# Altium schematic sheet Power.SchDoc
size A; SheetNumber: 2; SheetTotal: 3
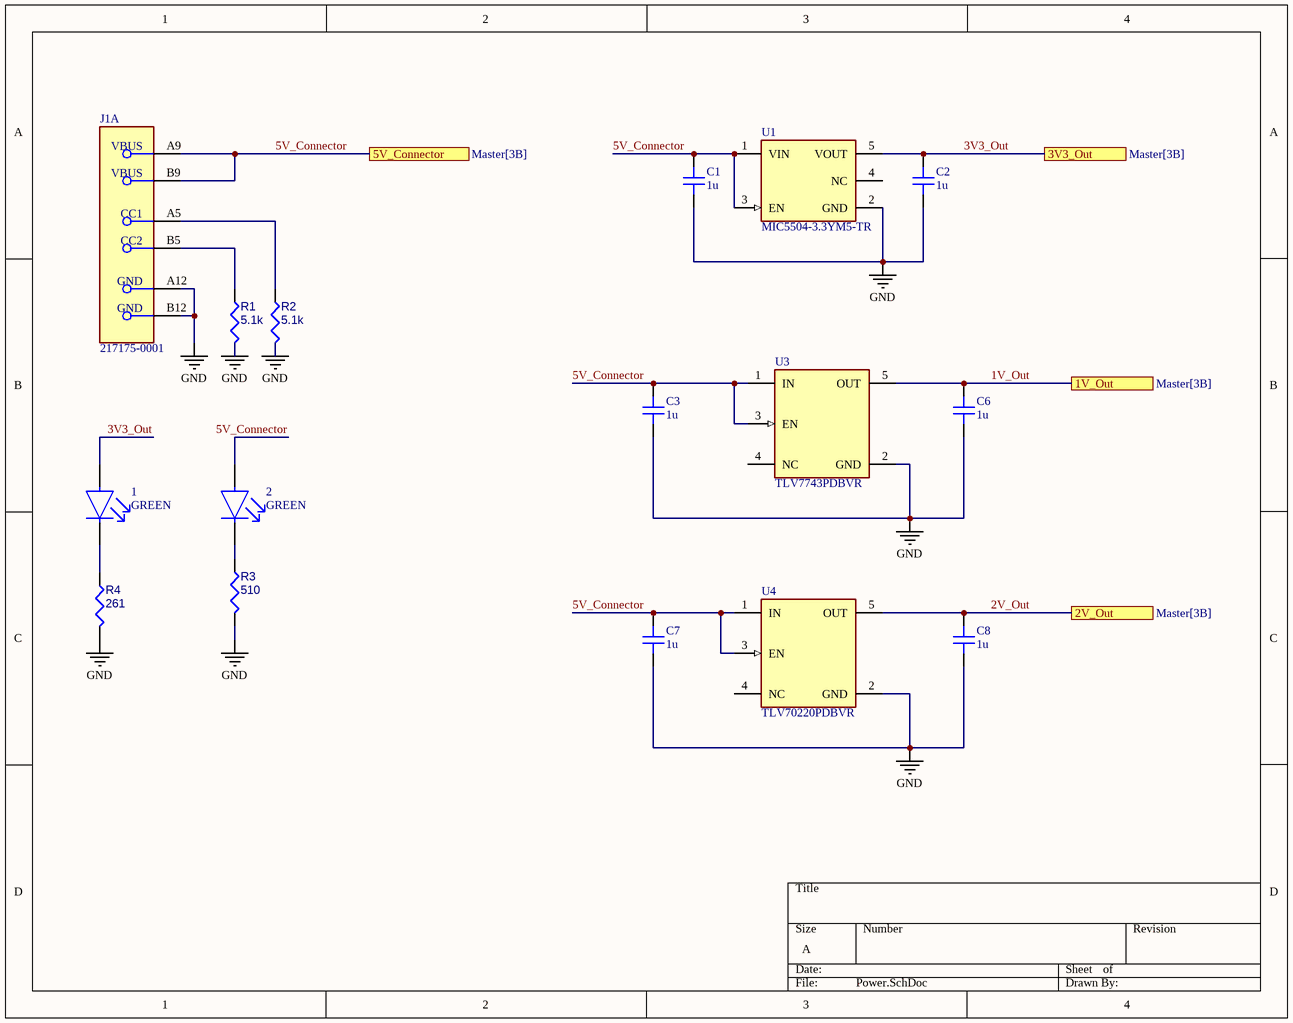
[diagram p0: Power.SchDoc]

## Parts
1  GREEN  [FP-ASMT-RF45-AN002-MFG]
2  GREEN  [FP-ASMT-RF45-AN002-MFG]
C1  value 1u  [CAP 0603_1608]
C2  value 1u  [CAP 0603_1608]
C3  value 1u  [CAP 0603_1608]
C6  value 1u  [CAP 0603_1608]
C7  value 1u  [CAP 0603_1608]
C8  value 1u  [CAP 0603_1608]
J1  217175-0001  [FP-217175-0001-MFG]  (part A of 2)
R1  5.1k  [RESC1608X55X25ML10T15]
R2  5.1k  [RESC1608X55X25ML10T15]
R3  510  [RESC1608X55X25ML10T15]
R4  261  [RESC1608X55X25ML10T15]
U1  MIC5504-3.3YM5-TR  [FP-SOT23-5LD-PL-1-IPC_B]
U3  TLV7743PDBVR  [FP-DBV0005A-IPC_C]
U4  TLV70220PDBVR  [FP-DBV0005A-IPC_C]

## Ports
1V_Out (see Master[3B]), 2V_Out (see Master[3B]), 3V3_Out (see Master[3B]), 5V_Connector (see Master[3B])

## Nets
GND: C1.2 C2.2 C3.2 C6.2 C7.2 C8.2 J1.A12(GND) J1.B12(GND) R1.2 R2.2 R3.2 R4.2 U1.2(GND) U3.2(GND) U4.2(GND)
1V_Out: C6.1 U3.5(OUT) ; port 1V_Out
2V_Out: C8.1 U4.5(OUT) ; port 2V_Out
3V3_Out: 1.2(A) C2.1 U1.5(VOUT) ; port 3V3_Out
5V_Connector: 2.2(A) C1.1 C3.1 C7.1 J1.A9(VBUS) J1.B9(VBUS) U1.1(VIN) U1.3(EN) U3.1(IN) U3.3(EN) U4.1(IN) U4.3(EN) ; port 5V_Connector
Net1_1: 1.1(C) R4.1
Net2_1: 2.1(C) R3.1
NetJ1_A5: J1.A5(CC1) R2.1
NetJ1_B5: J1.B5(CC2) R1.1

Not connected (* = marked no-connect by the designer): U1 4(NC); U3 4(NC); U4 4(NC)

## Library data of the parts
1 2 = CMP-2000-05796-2: ASMT-RF45-AN002 LED YLW/GREEN DIFFUSED 0603 SMD; Manufacturer: Broadcom; Viewing Angle: 145°; Reverse Voltage: 5V; Luminous Intensity: 60mcd; Forward Voltage: 2V; Wavelength: 573nm; Forward Current: 20mA; Led Orientation: Top View; Max Junction Temp: +110°C; Peak Emmision Wavelength: 574nm; Power Dissipation: 48mW; RoHS: TRUE; Category: Diode; Height: 0.55mm; Package: ASMT-RF45-AN002; Device Class L1: Optoelectronics; Temperature: -40°C to +100°C; Colour: Yellow Green; ComponentLink2URL: https://docs.broadcom.com/docs/AV02-0378EN; Mouser Description: LED; SMD; 0603; yellow green; 28-60mcd; 1.6x0.8x0.45mm; 145°; 20mA; Temperature Range High: +100°C; Temperature Range Low: -40°C; Octopart: https://octopart.com/asmt-rf45-an002-broadcom-71127304; Lead Free: Yes; ComponentLink2Description: Datasheet; Device Class L2: LEDs; Manufacturer Part Number: ASMT-RF45-AN002; Digikey Description: LED YLW/GREEN DIFFUSED 0603 SMD; Automotive: No; Device Class L3: unset
C1-C3 C6-C8 = CMP-184-001772-1: Part Number: ZRB18AR6YA475ME05L; manufacturer: Murata Electronics; Capacitance: 4.7 µF; Tolerance: ±20%; Voltage - Rated: 35V; Temperature Coefficient: X5R; ComponentLink1URL: https://search.murata.co.jp/Ceramy/image/img/A01X/G101/ENG/ZRB18AR6YA475ME05-01.pdf; Package / Case: 0603 (1608 Metric); series: ZRB; Mounting Type: Surface Mount, MLCC; ComponentLink2Description: DigiKey Link; partid: 9721; Device Package: 0603 (1608 Metric); Lifecycle Status: Active; packaging: TapeAndReel; Applications: Acoustic Noise Reduction; Part Status: Active; Thickness (Max): 0.047" (1.20mm); lastupdated: 9/19/2022 1:00:59 PM; Operating Temperature: -55°C ~ 85°C; ComponentLink2URL: https://www.digikey.com/en/products/detail/murata-electronics/ZRB18AR6YA475ME05L/7595507; price: 0.10; ComponentLink1Description: Datasheet; Minimum Order: 1; Size / Dimension: 0.063" L x 0.031" W (1.60mm x 0.80mm); Features: Interposer Termination
J1 = CMP-002-00112-1: Conn USB 2.0 Type C F 6 POS 1.23mm/1.02mm/1mm Solder RA SMD 6 Terminal 1 Port
R1-R4 = CMP-009-00014-4: Chip Resistor, +/-1%, 0.1 W, -55 to 155 degC, 0603 (1608 Metric); Value: 10 kOhms; Power: 100mW; Tolerance: 1%; Voltage Rating: 50V; Max Operating Temperature: 155°C; Pins: 2; RoHS Compliant: True; Case/Package: 0603; Min Operating Temperature: -55°C; Mounting Technology: SM
U1 = CMP-008-00006-1: Fixed Positive LDO Regulator, 3.3V, 0.38V Dropout, CMOS, PDSO5; RoHS Compliant: Yes
U3 U4 = CMP-019-00061-1: Fixed Positive LDO Regulator, 2V, CMOS, PDSO5; Max Supply Voltage: 5.5V; RoHS Compliant: Yes; Case/Package: LSSOP; Pins: 5